# Altium schematic sheet SCH_LEDS.SchDoc
size A; SheetNumber: 6; SheetTotal: 6
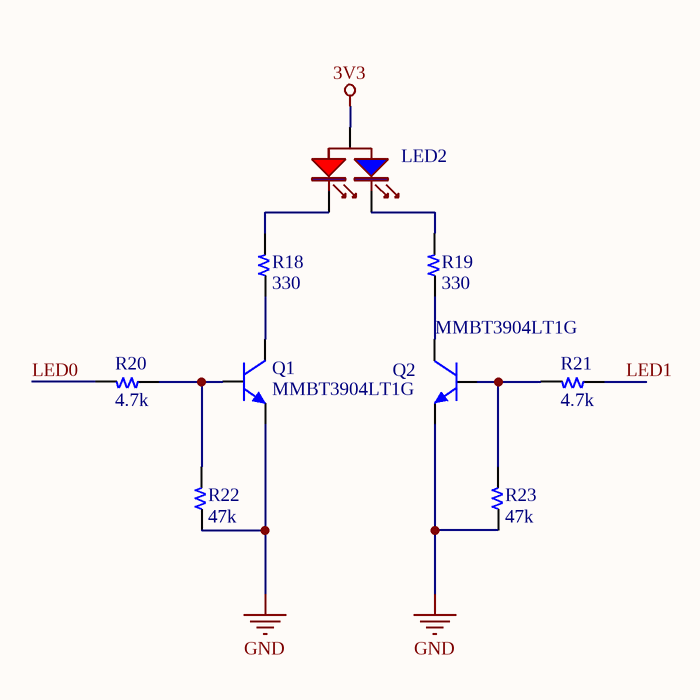
[diagram p0: SCH_LEDS.SchDoc]

## Parts
LED2  RB LED  [LED-BICOLOR-3MM]  (value not drawn)
Q1  MMBT3904LT1G  [SOT-23]
Q2  MMBT3904LT1G  [SOT-23]
R18  330  [R 0603]
R19  330  [R 0603]
R20  4.7k  [R 0603]
R21  4.7k  [R 0603]
R22  47k  [R 0603]
R23  47k  [R 0603]

## Nets
3V3: LED2.2(A)
GND: Q1.2(E) Q2.2(E) R22.1 R23.1
LED0: R20.2
LED1: R21.1
NetLED2_1: LED2.1(K1) R18.2
NetLED2_3: LED2.3(K2) R19.2
NetQ1_1: Q1.1(B) R20.1 R22.2
NetQ1_3: Q1.3(C) R18.1
NetQ2_1: Q2.1(B) R21.2 R23.2
NetQ2_3: Q2.3(C) R19.1

## Library data of the parts
LED2 = LED 2-color-A: Bicolor RB 3mm LED
Q1 Q2 = Transistor NPN: NPN Bipolar Transistor
R18-R23 = Resistor